# EAGLE design avr-fusebit-doctor-adapter-tqfp32 (EAGLE 7.7.0)
AUTHOR: PAWEL KISIELEWSKI (MANEKINEN); REV: 2.0
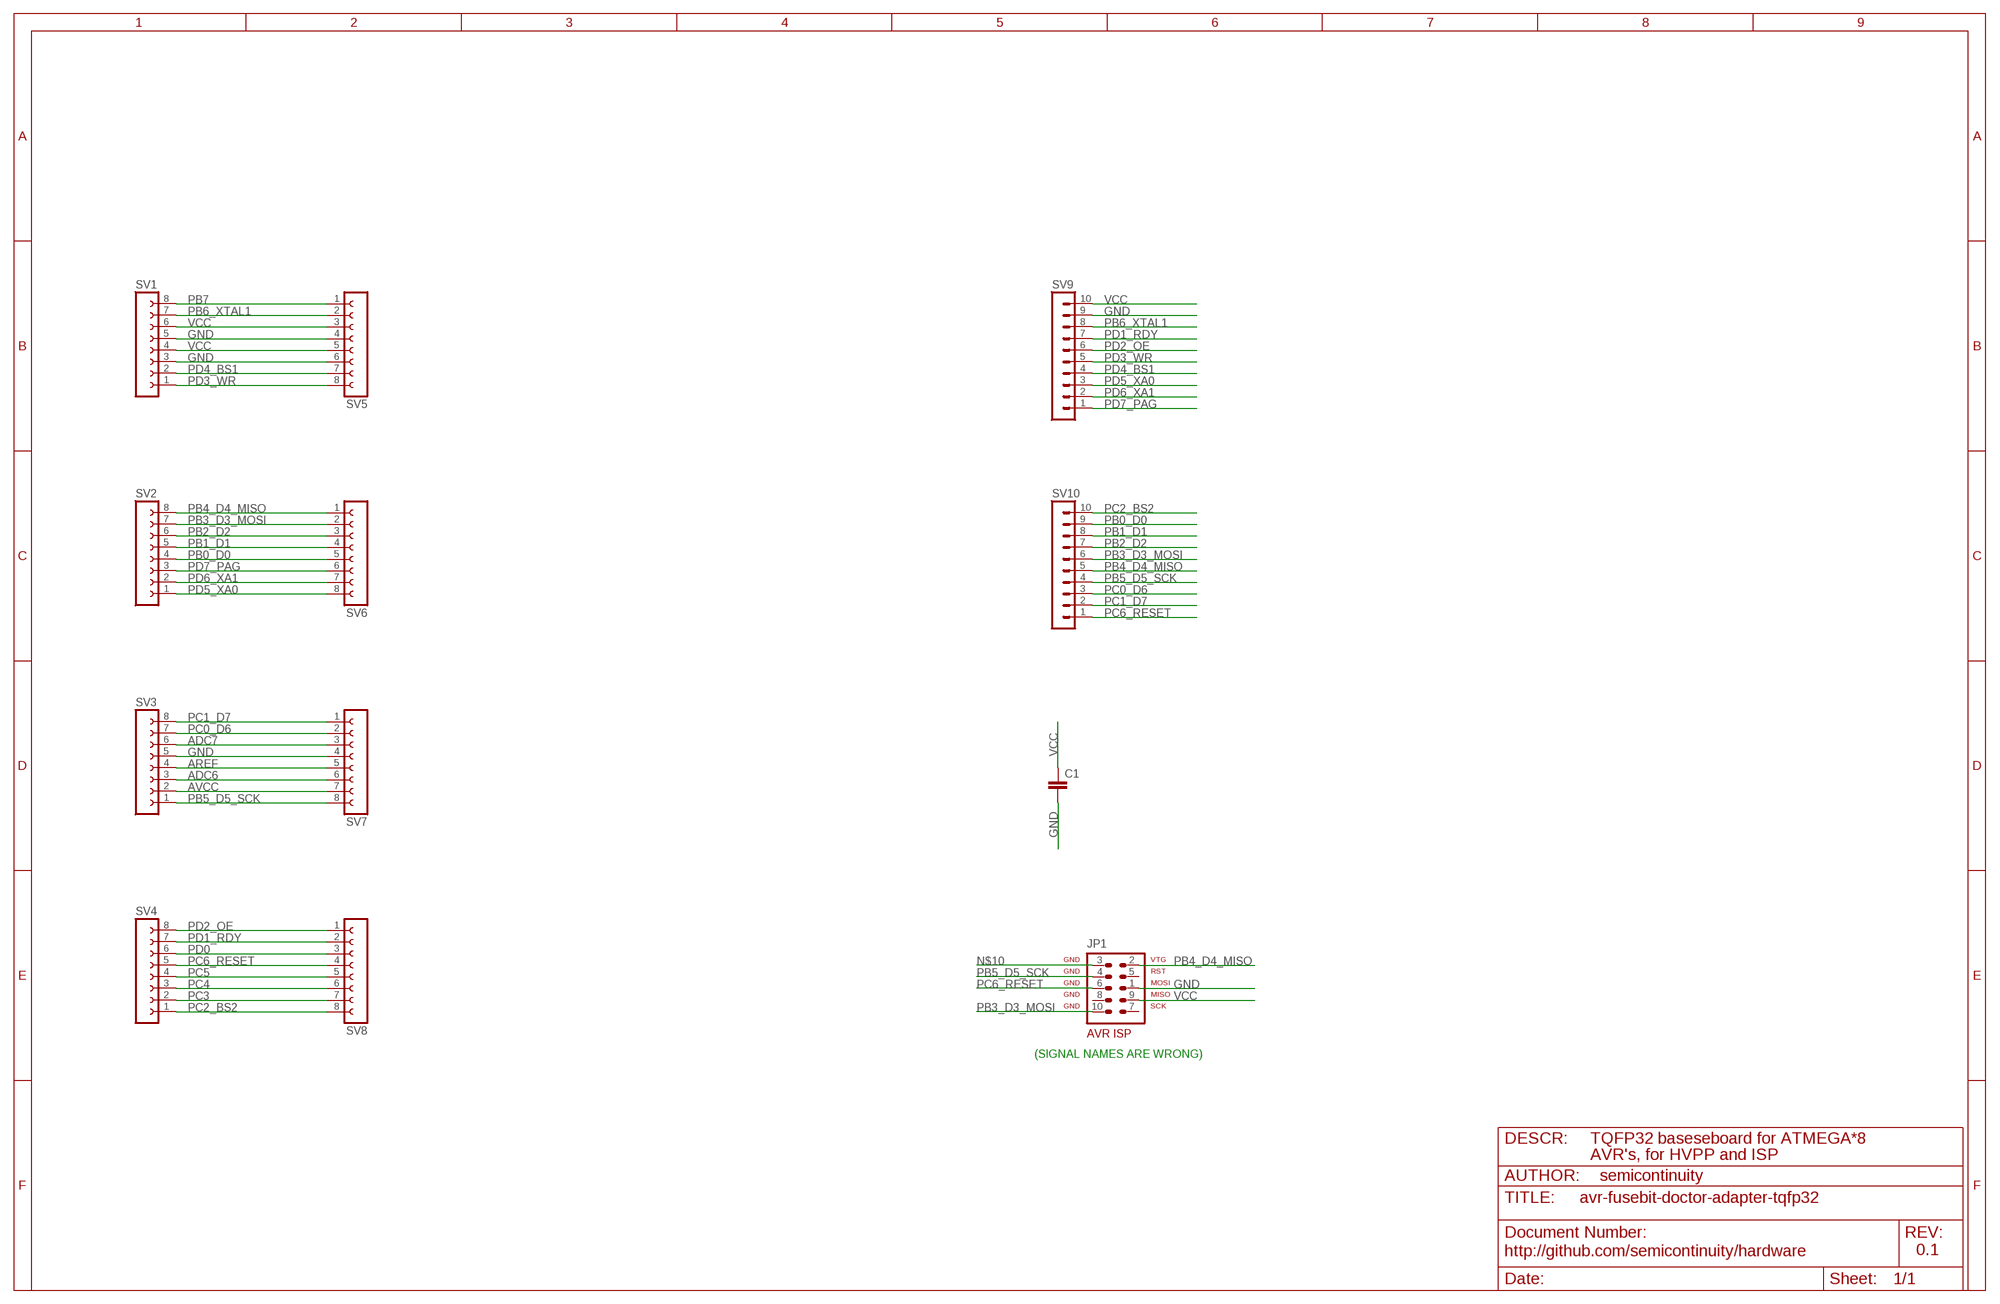
[diagram p0: schematic, sheet 1]

## Parts
C1  C-EUC0805  [C0805]
JP1  AVR-ISP-10  [AVR-ISP-10]
SV1  FE08-1  [FE08]
SV2  FE08-1  [FE08]
SV3  FE08-1  [FE08]
SV4  FE08-1  [FE08]
SV5  FE08-1  [FE08]
SV6  FE08-1  [FE08]
SV7  FE08-1  [FE08]
SV8  FE08-1  [FE08]
SV9  MA10-1  [MA10-1]
SV10  MA10-1  [MA10-1]

## Nets
ADC6: SV3.3 SV7.6
ADC7: SV3.6 SV7.3
AREF: SV3.4 SV7.5
AVCC: SV3.2 SV7.7
GND: C1.2 JP1.1 SV1.3 SV1.5 SV3.5 SV5.4 SV5.6 SV7.4 SV9.9
N$10: JP1.3
PB0_D0: SV2.4 SV6.5 SV10.9
PB1_D1: SV2.5 SV6.4 SV10.8
PB2_D2: SV2.6 SV6.3 SV10.7
PB3_D3_MOSI: JP1.10 SV2.7 SV6.2 SV10.6
PB4_D4_MISO: JP1.2 SV2.8 SV6.1 SV10.5
PB5_D5_SCK: JP1.4 SV3.1 SV7.8 SV10.4
PB6_XTAL1: SV1.7 SV5.2 SV9.8
PB7: SV1.8 SV5.1
PC0_D6: SV3.7 SV7.2 SV10.3
PC1_D7: SV3.8 SV7.1 SV10.2
PC2_BS2: SV4.1 SV8.8 SV10.10
PC3: SV4.2 SV8.7
PC4: SV4.3 SV8.6
PC5: SV4.4 SV8.5
PC6_RESET: JP1.6 SV4.5 SV8.4 SV10.1
PD0: SV4.6 SV8.3
PD1_RDY: SV4.7 SV8.2 SV9.7
PD2_OE: SV4.8 SV8.1 SV9.6
PD3_WR: SV1.1 SV5.8 SV9.5
PD4_BS1: SV1.2 SV5.7 SV9.4
PD5_XA0: SV2.1 SV6.8 SV9.3
PD6_XA1: SV2.2 SV6.7 SV9.2
PD7_PAG: SV2.3 SV6.6 SV9.1
VCC: C1.1 JP1.9 SV1.4 SV1.6 SV5.3 SV5.5 SV9.10
Unconnected: JP1.5 JP1.7 JP1.8

## Notes on the sheet
- (SIGNAL NAMES ARE WRONG)
- DESCR: | TQFP32 baseseboard for ATMEGA*8
- AVR's, for HVPP and ISP
- AUTHOR: | semicontinuity
- http://github.com/semicontinuity/hardware | 0.1

## Library data of the parts
C1 = rcl:C-EU: CAPACITOR, European symbol
JP1 = my-atmel:AVR-ISP-10: AVR ISP-10 Serial Programming Header
SV1-SV8 = con-lsta:FE08-1: FEMALE HEADER; OC_FARNELL: unknown; OC_NEWARK: unknown
SV9 SV10 = con-lstb:MA10-1: PIN HEADER; OC_FARNELL: unknown; OC_NEWARK: unknown

## Board
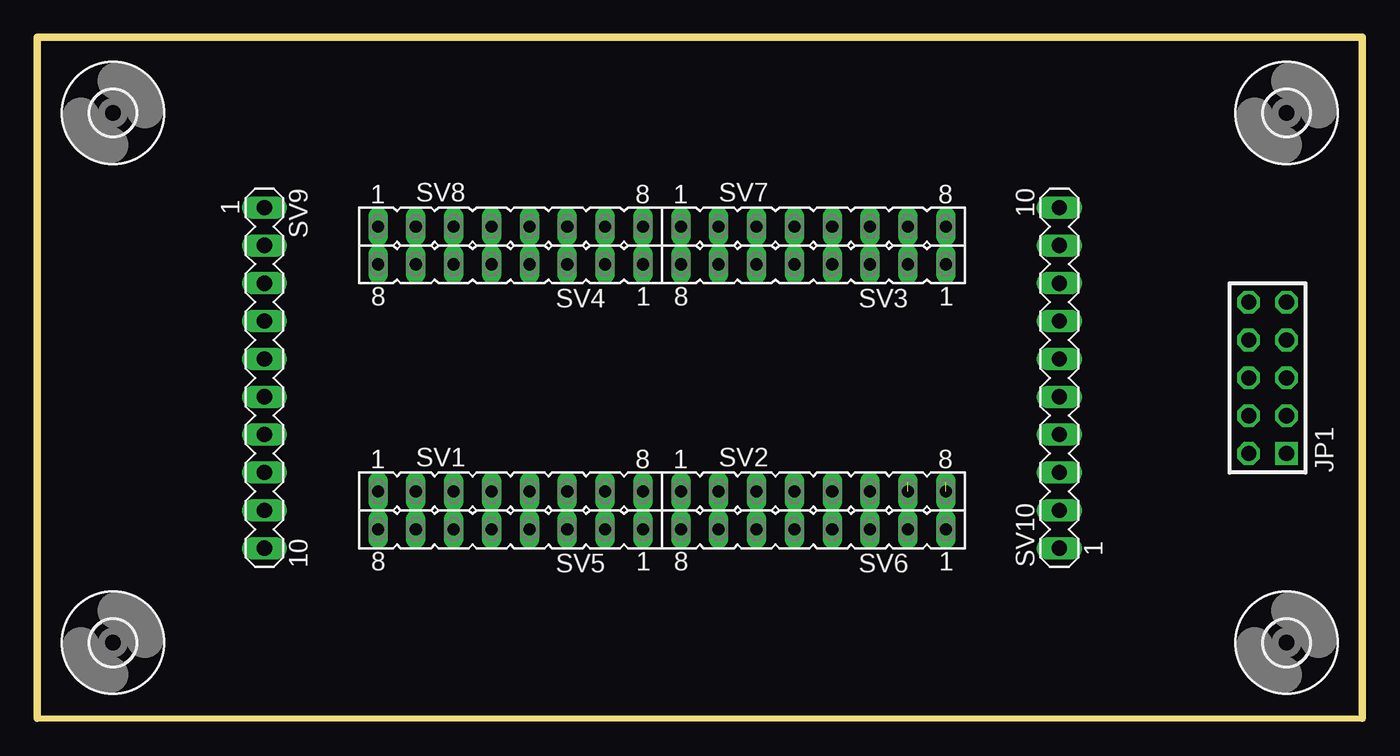
[diagram p1: board, top side]
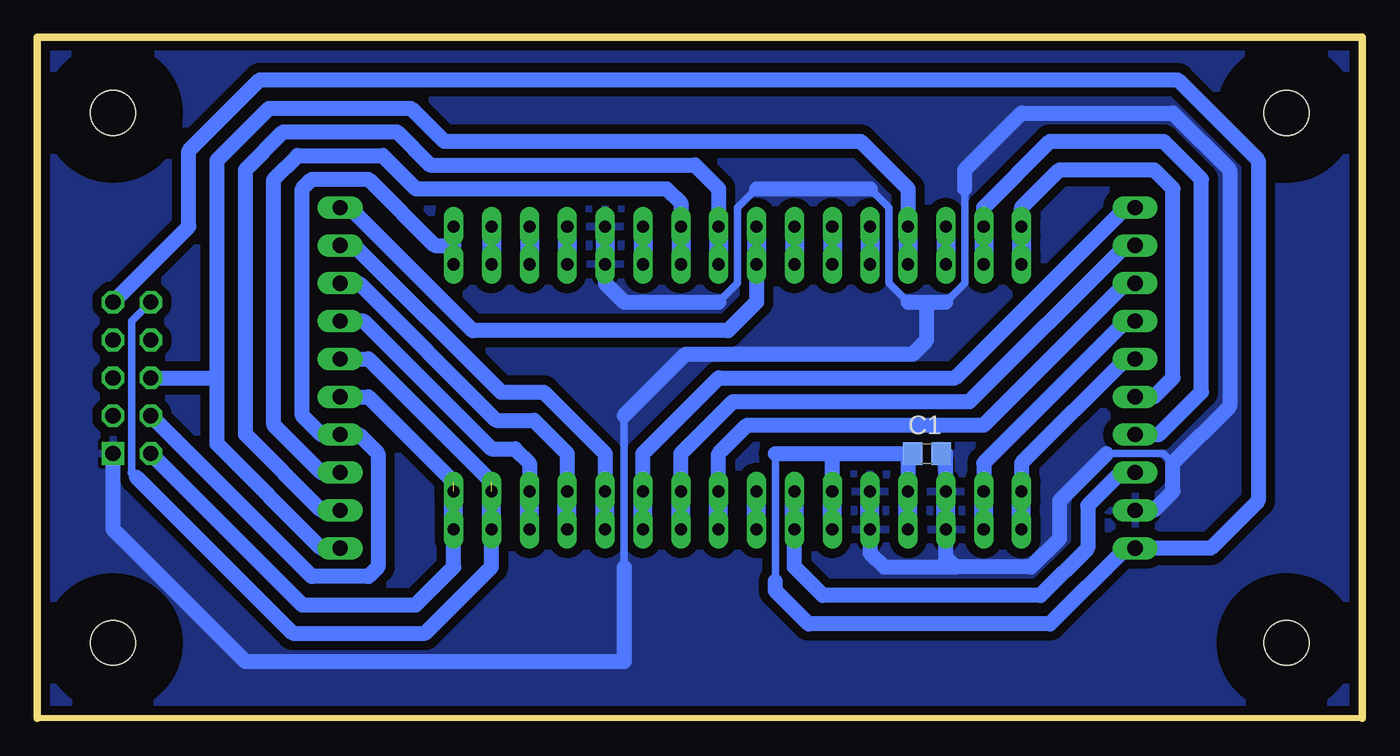
[diagram p2: board, bottom side, seen from below]

Size 88.9 x 45.72 mm. Coordinates in mm from the lower left corner, seen from the top.
Outline: 0,0 88.9,0 88.9,45.72 0,45.72 0,0
Copper layers (1*16): Top 0.035mm / dielectric 1.5mm / Bottom 0.035mm
Design rules "default *": minimum track width 10mil, minimum drill 24mil, track to track 24mil, track to pad 24mil, pad to pad 8mil, via to via 8mil, smd to smd 8mil, copper to edge 8mil, drill to drill 8mil, minimum pad ring 10mil, minimum via ring 8mil, stop-mask expansion 4mil, vias tented up to drill 0mil, thermal gap 10mil
tKeepout: 8 lines

### Footprints (pad centres in the part's own frame; a part is rotated, then mirrored left to right if it is on the bottom)
C0805 = smd 1.3 x 1.5: 1 -0.95,0; 2 0.95,0
AVR-ISP-10 = drill 1.016 square: 1 -5.08,-1.27 | drill 1.016 octagon: 2 -5.08,1.27; 3 -2.54,-1.27; 4 -2.54,1.27; 5 0,-1.27; 6 0,1.27; 7 2.54,-1.27; 8 2.54,1.27; 9 5.08,-1.27; 10 5.08,1.27
FE08 = drill 0.813 long: 1 -8.89,0; 2 -6.35,0; 3 -3.81,0; 4 -1.27,0; 5 1.27,0; 6 3.81,0; 7 6.35,0; 8 8.89,0
MA10-1 = drill 1.016 long: 1 -11.43,0; 2 -8.89,0; 3 -6.35,0; 4 -3.81,0; 5 -1.27,0; 6 1.27,0; 7 3.81,0; 8 6.35,0; 9 8.89,0; 10 11.43,0
3,0 = hole 3: 0,0

### Placement (x,y rotation side)
C1  29.21,17.78 0 bottom
JP1  82.55,22.86 90 top
SV1  31.75,15.24 0 top
SV2  52.07,15.24 0 top
SV3  52.07,30.48 180 top
SV4  31.75,30.48 180 top
SV5  31.75,12.7 180 top
SV6  52.07,12.7 180 top
SV7  52.07,33.02 0 top
SV8  31.75,33.02 0 top
SV9  15.24,22.86 270 top
SV10  68.58,22.86 90 top
U$1  [3,0]  5.08,40.64 0 top
U$2  [3,0]  5.08,5.08 0 top
U$3  [3,0]  83.82,5.08 0 top
U$4  [3,0]  83.82,40.64 0 top

### Tracks (layer width: path | path; a pad name or v marks a point on that pad's centre or on a via)
ADC6
  Bottom 1.27: SV7.6 SV3.3
ADC7
  Bottom 1.27: SV7.3 SV3.6
AREF
  Bottom 1.27: SV7.5 SV3.4
AVCC
  Bottom 1.27: SV7.7 SV3.2
GND
  Bottom 0.508: 12.7,17.14 13.34,17.78 17.14,17.78 | 43.18,27.94 41.91,29.21 41.91,34.29 40.64,35.56 | 33.02,35.56 31.75,34.29 31.75,29.21 30.48,27.94 | 27.94,27.94 26.67,29.21 26.67,35.56 | 49.53,10.16 49.53,20.32
  Bottom 1.016: SV9.9 13.97,13.97 12.7,15.24 12.7,17.14 8.89,20.95 8.89,36.83 12.7,40.64 22.86,40.64 26.67,36.83 26.67,35.56 | 17.14,17.78 20.32,14.61 20.32,12.06 22.23,10.16 27.3,10.16 | 27.3,10.16 27.94,10.79 SV5.6 | SV1.5 33.02,11.11 32.07,10.16 27.3,10.16 | SV1.3 27.94,17.78 C1.2 | SV3.5 50.8,29.21 49.53,27.94 43.18,27.94 | 40.64,35.56 33.02,35.56 | 30.48,27.94 29.21,27.94 | 29.21,27.94 27.94,27.94 | 49.53,20.32 45.4,24.45 30.16,24.45 29.21,25.4 29.21,27.94 | 49.53,10.16 49.53,3.81 74.93,3.81 83.82,12.7 JP1.1
  Bottom 1.27: SV5.6 SV1.3 | SV5.4 SV1.5 | SV7.4 SV3.5
  pour Bottom (isolate 0.61): 0,0 88.9,0 88.9,45.72 0,45.72
PB0_D0
  Bottom 1.016: SV10.9 67.63,31.75 57.78,21.91 54.93,21.91 50.8,17.78 SV2.4
  Bottom 1.27: SV6.5 SV2.4
PB1_D1
  Bottom 1.016: SV10.8 67.31,29.21 58.1,20 55.56,20 53.34,17.78 SV2.5
  Bottom 1.27: SV6.4 SV2.5
PB2_D2
  Bottom 1.016: SV10.7 66.99,26.67 58.42,18.1 56.83,18.1 55.88,17.14 SV2.6
  Bottom 1.27: SV6.3 SV2.6
PB3_D3_MOSI  (1 unrouted)
  Bottom 0.508: JP1.10 82.55,26.67 82.55,16.51
  Bottom 0.61: 82.55,16.51 82.23,16.19
  Bottom 1.016: SV10.6 66.67,24.13 58.42,15.88 | 82.23,16.19 71.75,5.71 62.87,5.71 58.42,10.16 SV6.2
  Bottom 1.27: SV6.2 SV2.7
PB4_D4_MISO  (1 unrouted)
  Bottom 1.016: SV10.5 66.67,21.59 60.96,15.88 | JP1.2 71.12,7.62 63.5,7.62 60.96,10.16 SV6.1
  Bottom 1.27: SV6.1 SV2.8
PB5_D5_SCK
  Bottom 1.016: SV3.1 60.96,31.75 | 60.96,31.75 SV7.8 | 60.96,31.75 62.23,31.75 66.67,36.2 70.48,36.2 71.12,35.56 71.12,20.32 69.85,19.05 SV10.4 67.31,19.05 66.04,17.78 66.04,10.16 66.67,9.53 70.48,9.53 JP1.4
PB6_XTAL1
  Bottom 1.016: SV9.8 16.19,16.51 18.41,14.29 18.41,11.43 21.59,8.26 36.2,8.26 38.1,10.16 SV5.2
  Bottom 1.27: SV5.2 SV1.7
PB7
  Bottom 1.27: SV5.1 SV1.8
PC0_D6
  Bottom 1.016: SV10.3 69.85,16.51 73.03,19.68 73.03,36.2 71.44,37.78 65.72,37.78 63.5,35.56 46.67,35.56 45.72,34.61 SV7.2
  Bottom 1.27: SV7.2 SV3.7
PC1_D7
  Bottom 1.016: SV10.2 69.85,13.97 74.93,19.05 74.93,36.83 72.39,39.37 64.77,39.37 62.55,37.15 44.77,37.15 43.18,35.56 SV7.1
  Bottom 1.27: SV7.1 SV3.8
PC2_BS2
  Bottom 1.016: SV10.10 67.94,34.29 59.69,26.04 42.55,26.04 40.64,27.94 SV4.1
  Bottom 1.27: SV8.8 SV4.1
PC3
  Bottom 1.27: SV8.7 SV4.2
PC4
  Bottom 1.27: SV8.6 SV4.3
PC5
  Bottom 1.27: SV8.5 SV4.4
PC6_RESET
  Bottom 1.016: SV10.1 69.85,11.43 76.83,18.41 76.83,22.86 | 76.83,22.86 76.83,37.47 73.34,40.96 63.82,40.96 61.59,38.73 33.66,38.73 30.48,35.56 SV8.4 | JP1.6 76.83,22.86
  Bottom 1.27: SV8.4 SV4.5
PD0
  Bottom 1.27: SV8.3 SV4.6
PD1_RDY
  Bottom 1.016: SV9.7 13.65,19.05 10.79,21.91 10.79,36.2 13.34,38.73 20.95,38.73 25.4,34.29 SV8.2
  Bottom 1.27: SV8.2 SV4.7
PD2_OE
  Bottom 1.016: SV9.6 13.97,21.59 12.7,22.86 12.7,35.56 13.97,36.83 20.32,36.83 22.86,34.29 SV8.1
  Bottom 1.27: SV8.1 SV4.8
PD3_WR
  Bottom 1.016: SV9.5 15.88,24.13 22.86,17.14 SV1.1
  Bottom 1.27: SV5.8 SV1.1
PD4_BS1
  Bottom 1.016: SV9.4 15.88,26.67 25.4,17.14 SV1.2
  Bottom 1.27: SV5.7 SV1.2
PD5_XA0
  Bottom 1.016: SV2.1 43.18,17.78 41.27,19.68 25.4,19.68 15.88,29.21 SV9.3
  Bottom 1.27: SV6.8 SV2.1
PD6_XA1
  Bottom 1.016: SV2.2 45.72,17.78 42.23,21.27 26.35,21.27 15.88,31.75 SV9.2
  Bottom 1.27: SV6.7 SV2.2
PD7_PAG
  Bottom 1.016: SV6.6 48.26,17.78 43.18,22.86 27.3,22.86 15.88,34.29 SV9.1
  Bottom 1.27: SV6.6 SV2.3
VCC
  Bottom 0.508: 39.37,9.21 39.37,17.78
  Bottom 1.016: 39.37,9.21 39.37,8.57 37.15,6.35 20.95,6.35 15.88,11.43 SV9.10 10.16,11.43 6.99,14.61 6.99,37.47 12.38,42.86 73.98,42.86 78.74,38.1 78.74,33.02 JP1.9 | 39.37,17.78 35.56,17.78 | 35.56,17.78 30.48,17.78 | 30.48,17.78 SV1.4 | SV1.6 35.56,17.78 | C1.1 30.48,17.78
  Bottom 1.27: SV5.5 SV1.4 | SV5.3 SV1.6